# Altium schematic sheet CSP_simulation.SchDoc
size A4
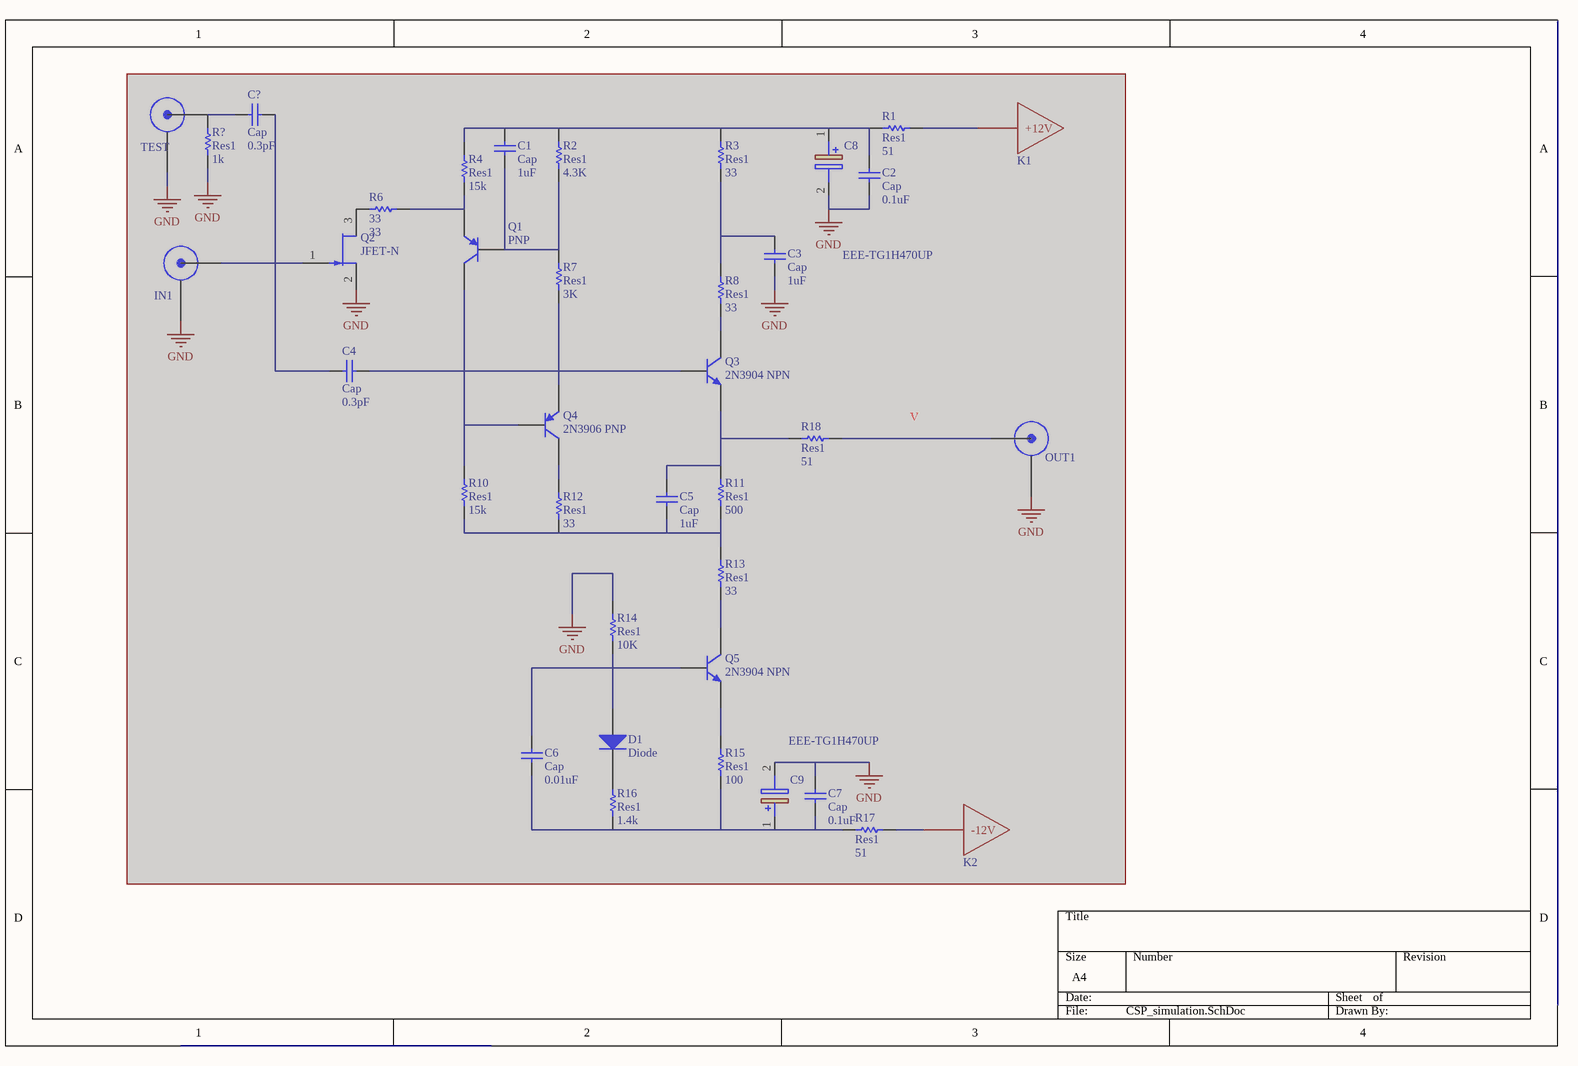
[diagram p0: CSP_simulation.SchDoc]

## Parts
C1  Cap  value 1uF  [*CAPC2012X94N]  (masked out: inside a compile mask, not in the netlist)
C2  Cap  value 0.1uF  [*CAPC2012X94N]  (masked out: inside a compile mask, not in the netlist)
C3  Cap  value 1uF  [*CAPC2012X94N]  (masked out: inside a compile mask, not in the netlist)
C4  Cap  value 0.3pF  [0603]  (masked out: inside a compile mask, not in the netlist)
C5  Cap  value 1uF  [*CAPC2012X94N]  (masked out: inside a compile mask, not in the netlist)
C6  Cap  value 0.01uF  [*CAPC2012X94N]  (masked out: inside a compile mask, not in the netlist)
C7  Cap  value 0.1uF  [*CAPC2012X94N]  (masked out: inside a compile mask, not in the netlist)
C8  EEE-TG1H470UP  [CAPAE830X1050N]  (masked out: inside a compile mask, not in the netlist)
C9  EEE-TG1H470UP  [CAPAE830X1050N]  (masked out: inside a compile mask, not in the netlist)
C?  Cap  value 0.3pF  [0603]  (masked out: inside a compile mask, not in the netlist)
D1  Diode  [SODFL350X110-2N]  (masked out: inside a compile mask, not in the netlist)
IN1  INPUT  [IN/OUT]  (value not drawn)  (masked out: inside a compile mask, not in the netlist)
K1  +12V  [PAD]  (value not drawn)  (masked out: inside a compile mask, not in the netlist)
K2  -12V  [PAD]  (value not drawn)  (masked out: inside a compile mask, not in the netlist)
OUT1  OUTPUT  [IN/OUT]  (value not drawn)  (masked out: inside a compile mask, not in the netlist)
Q1  PNP  [SOT-23B_N]  (masked out: inside a compile mask, not in the netlist)
Q2  JFET-N  [SOT23_M]  (masked out: inside a compile mask, not in the netlist)
Q3  2N3904 NPN  [SOT23_M]  (masked out: inside a compile mask, not in the netlist)
Q4  2N3906 PNP  [SOT-23B_N]  (masked out: inside a compile mask, not in the netlist)
Q5  2N3904 NPN  [SOT23_M]  (masked out: inside a compile mask, not in the netlist)
R1  Res1  value 51  [SMD-0805-RES]  (masked out: inside a compile mask, not in the netlist)
R2  Res1  value 4.3K  [SMD-0805-RES]  (masked out: inside a compile mask, not in the netlist)
R3  Res1  value 33  [SMD-0805-RES]  (masked out: inside a compile mask, not in the netlist)
R4  Res1  value 15k  [SMD-0805-RES]  (masked out: inside a compile mask, not in the netlist)
R6  33  [SMD-0805-RES]  (masked out: inside a compile mask, not in the netlist)
R7  Res1  value 3K  [SMD-0805-RES]  (masked out: inside a compile mask, not in the netlist)
R8  Res1  value 33  [SMD-0805-RES]  (masked out: inside a compile mask, not in the netlist)
R10  Res1  value 15k  [SMD-0805-RES]  (masked out: inside a compile mask, not in the netlist)
R11  Res1  value 500  [SMD-0805-RES]  (masked out: inside a compile mask, not in the netlist)
R12  Res1  value 33  [SMD-0805-RES]  (masked out: inside a compile mask, not in the netlist)
R13  Res1  value 33  [SMD-0805-RES]  (masked out: inside a compile mask, not in the netlist)
R14  Res1  value 10K  [SMD-0805-RES]  (masked out: inside a compile mask, not in the netlist)
R15  Res1  value 100  [SMD-0805-RES]  (masked out: inside a compile mask, not in the netlist)
R16  Res1  value 1.4k  [SMD-0805-RES]  (masked out: inside a compile mask, not in the netlist)
R17  Res1  value 51  [SMD-0805-RES]  (masked out: inside a compile mask, not in the netlist)
R18  Res1  value 51  [SMD-0805-RES]  (masked out: inside a compile mask, not in the netlist)
R?  Res1  value 1k  [SMD-0805-RES]  (masked out: inside a compile mask, not in the netlist)
TEST  INPUT  [IN/OUT]  (value not drawn)  (masked out: inside a compile mask, not in the netlist)

## Library data of the parts
C1-C7 C? = Cap: Capacitor; Published: 8-Jun-2000; LatestRevisionDate: 17-Jul-2002; LatestRevisionNote: Re-released for DXP Platform.; PackageReference: RAD-0.3; Publisher: Altium Limited; PackageDescription: Radial Cap, Thru-Hole; 2 Leads; 0.3 in Pin Spacing
C8 C9 = EEE-TG1H470UP: Capacitor Polarised; Manufacturer_Name: Panasonic; Datasheet Link: https://industrial.panasonic.com/cdbs/www-data/pdf/RDE0000/ABA0000C1187.pdf; Height: 10.5mm; Manufacturer_Part_Number: EEE-TG1H470UP
Q1 Q4 = PNP: PNP Bipolar Transistor; Published: 8-Jun-2000; LatestRevisionDate: 29-May-2009; LatestRevisionNote: IPC-7351 Footprint Added.; PackageVersion: Aug-1999; PackageReference: SOT-23B; Publisher: Altium Limited; PackageDescription: 3-Pin SOT-23 Package 0.95 mm Pitch, 2.4 mm Lead Span
Q2 = JFET-N: N-Channel JFET; Published: 8-Jun-2000; LatestRevisionDate: 17-Jul-2002; LatestRevisionNote: Re-released for DXP Platform.; PackageReference: TO-254-AA; Publisher: Altium Limited; Code_JEDEC: TO-254-AA
Q3 Q5 = NPN: NPN Bipolar Transistor; Published: 8-Jun-2000; LatestRevisionDate: 17-Jul-2002; LatestRevisionNote: Re-released for DXP Platform.; PackageReference: TO-226-AA; Publisher: Altium Limited; PackageDescription: TO, Flat Index; 3 In-Line, Axial Leads; Body Dia. 4.8mm; Leads 0.55 x 0.51 mm (max); Code_JEDEC: TO-226-AA
R1-R4 R6-R8 R10-R18 R? = Res1: Resistor; Published: 8-Jun-2000; LatestRevisionDate: 17-Jul-2002; LatestRevisionNote: Re-released for DXP Platform.; PackageReference: AXIAL-0.3; Publisher: Altium Limited; PackageDescription: Axial Device, Thru-Hole; 2 Leads; 0.3 in Pin Spacing
  R6: Value: 33